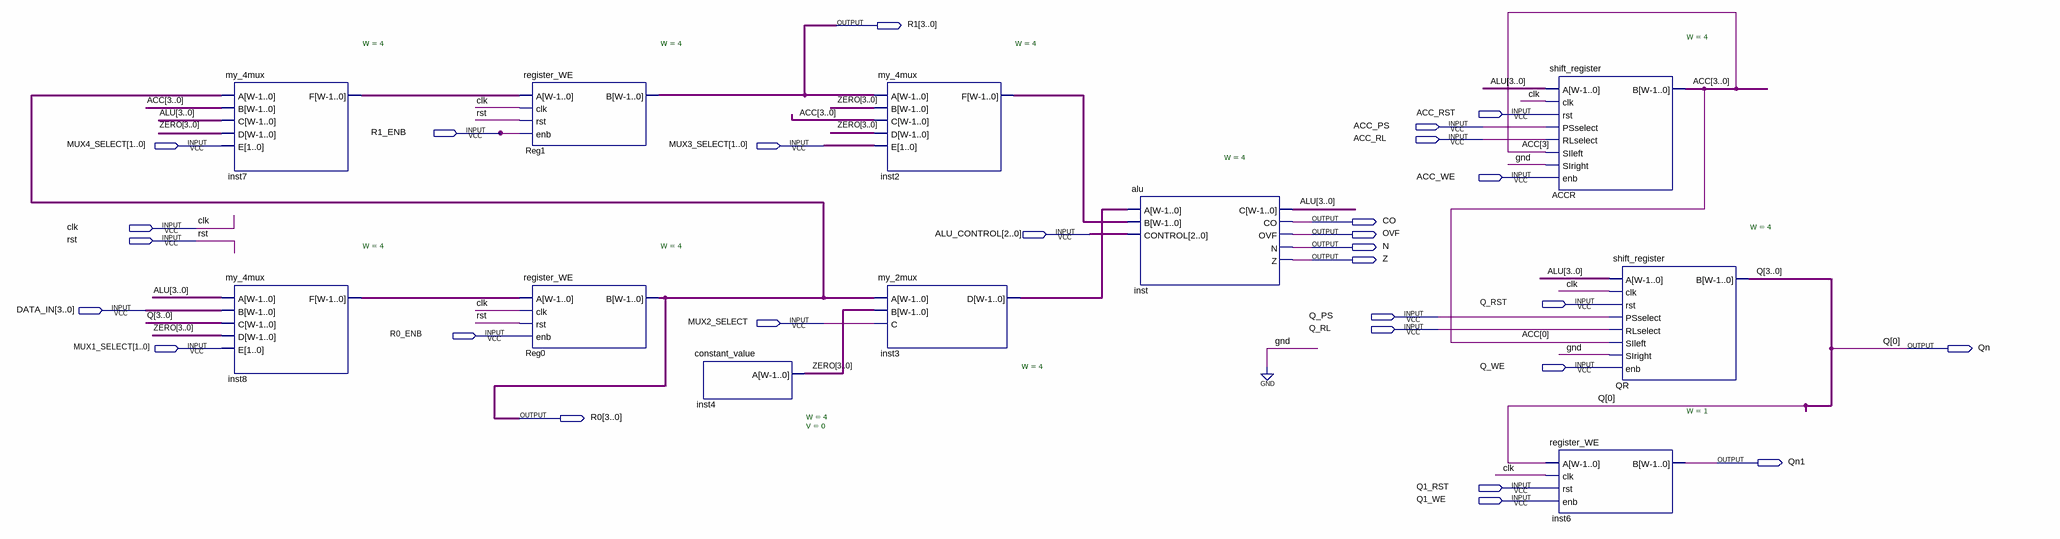
[diagram p0: schematic sheet]
// Quartus schematic datapath.bdf as structural Verilog: 11 symbols, 28 pins
module datapath (
  input  ACC_RST,
  input  ACC_PS,
  input  R1_ENB,
  input  ACC_RL,
  input  [1:0] MUX4_SELECT,
  input  [1:0] MUX3_SELECT,
  input  ACC_WE,
  input  clk,
  input  [2:0] ALU_CONTROL,
  input  rst,
  input  Q_RST,
  input  [3:0] DATA_IN,
  input  Q_PS,
  input  MUX2_SELECT,
  input  Q_RL,
  input  R0_ENB,
  input  [1:0] MUX1_SELECT,
  input  Q_WE,
  input  Q1_RST,
  input  Q1_WE,
  output [3:0] R1,
  output CO,
  output OVF,
  output N,
  output Z,
  output Qn,
  output [3:0] R0,
  output Qn1
);

  wire [3:0] ACC, ALU, inst2_f, inst3_d, inst7_f, inst8_f, ZERO;
  wire [3:1] Q;

  my_4mux #(.W(4)) inst7 (.A(R0), .B(ACC), .C(ALU), .D(ZERO), .E(MUX4_SELECT), .F(inst7_f));
  my_4mux #(.W(4)) inst8 (.A(ALU), .B(DATA_IN), .C({Q, Qn}), .D(ZERO), .E(MUX1_SELECT), .F(inst8_f));
  register_WE #(.W(4)) Reg1 (.A(inst7_f), .clk(clk), .rst(rst), .enb(R1_ENB), .B(R1));
  register_WE #(.W(4)) Reg0 (.A(inst8_f), .clk(clk), .rst(rst), .enb(R0_ENB), .B(R0));
  constant_value #(.W(4), .V(0)) inst4 (.A(ZERO));
  my_4mux #(.W(4)) inst2 (.A(R1), .B(ZERO), .C(ACC), .D(ZERO), .E(MUX3_SELECT), .F(inst2_f));
  my_2mux #(.W(4)) inst3 (.A(R0), .B(ZERO), .C(MUX2_SELECT), .D(inst3_d));
  alu #(.W(4)) inst (.A(inst3_d), .B(inst2_f), .CONTROL(ALU_CONTROL), .C(ALU), .CO(CO), .OVF(OVF), .N(N), .Z(Z));
  shift_register #(.W(4)) ACCR (
    .A(ALU), .clk(clk), .rst(ACC_RST), .PSselect(ACC_PS), .RLselect(ACC_RL), .SIleft(ACC[3]), .SIright(1'b0),
    .enb(ACC_WE), .B(ACC));
  register_WE #(.W(1)) inst6 (.A(Qn), .clk(clk), .rst(Q1_RST), .enb(Q1_WE), .B(Qn1));
  shift_register #(.W(4)) QR (
    .A(ALU), .clk(clk), .rst(Q_RST), .PSselect(Q_PS), .RLselect(Q_RL), .SIleft(ACC[0]), .SIright(1'b0),
    .enb(Q_WE), .B({Q, Qn}));

  // Other names for the same wires on the sheet: Q[0] = Qn
endmodule
